# EAGLE schematic transmitter_with_KS0108_LCD (EAGLE 7.7.0)
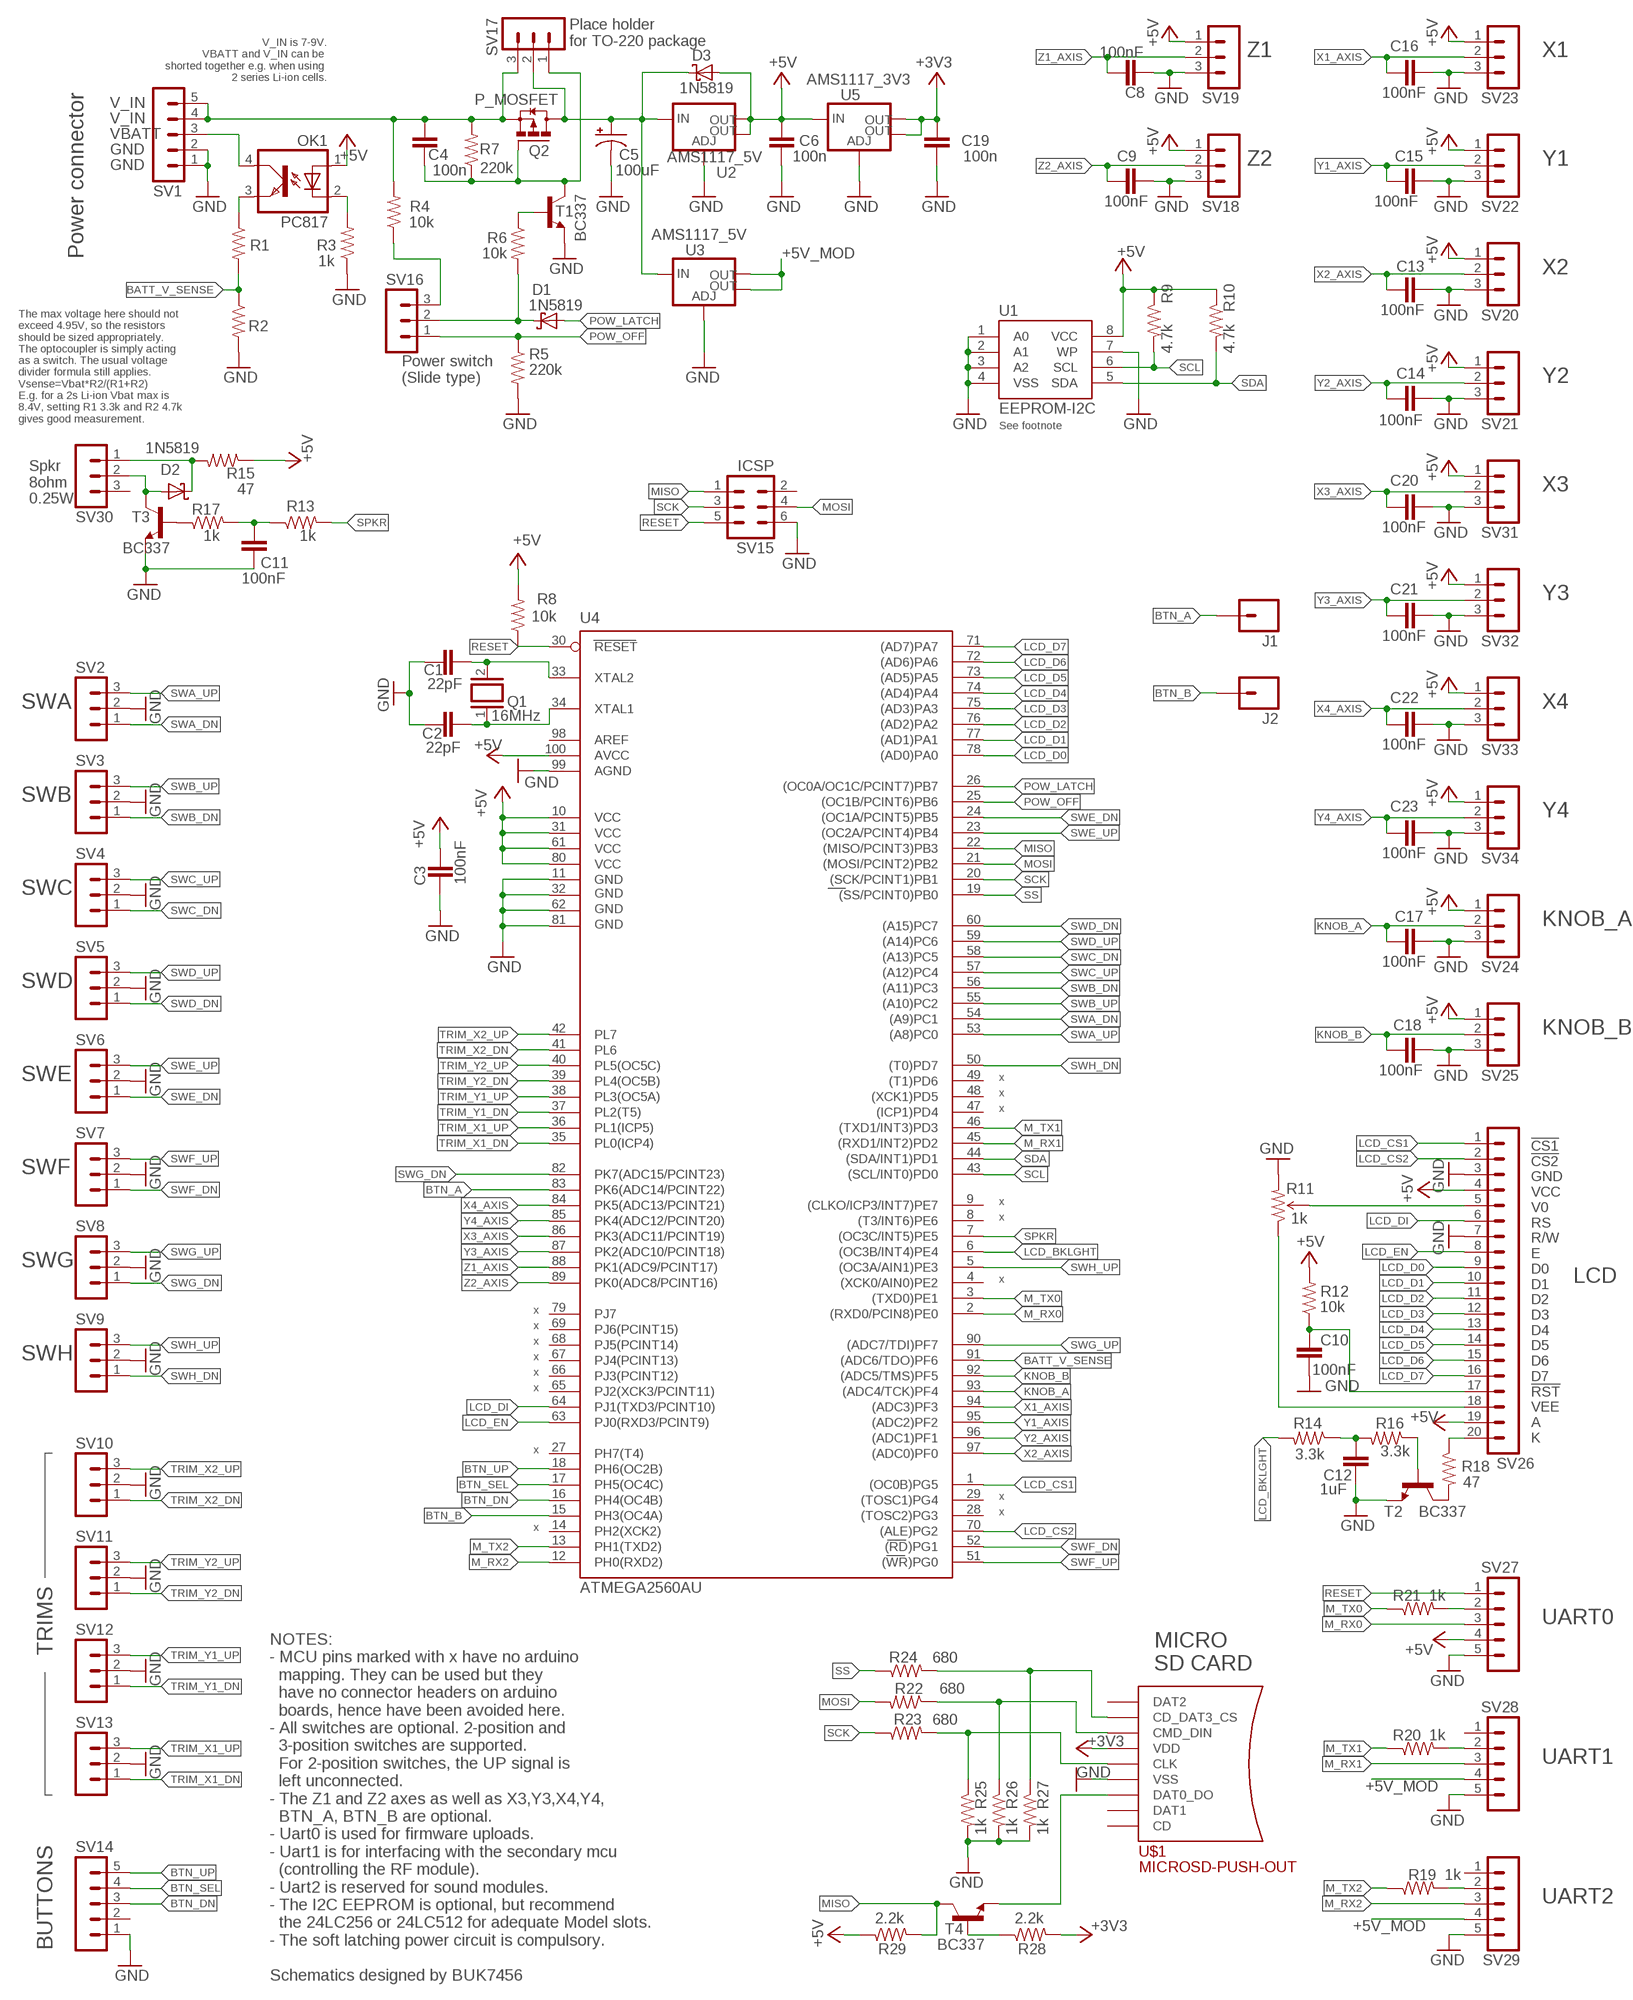
[diagram p0: schematic, sheet 1]

## Parts
C1  22pF  C-EU050-024X044  [C050-024X044]
C2  22pF  C-EU050-024X044  [C050-024X044]
C3  100nF  C-EU050-024X044  [C050-024X044]
C4  100n  C-EU050-024X044  [C050-024X044]
C5  100uF  CPOL-USE2,5-6E  [E2,5-6E]
C6  100n  C-EU050-024X044  [C050-024X044]
C8  100nF  C-EU050-024X044  [C050-024X044]
C9  100nF  C-EU050-024X044  [C050-024X044]
C10  100nF  C-EU050-024X044  [C050-024X044]
C11  100nF  C-EU050-024X044  [C050-024X044]
C12  1uF  C-EU050-024X044  [C050-024X044]
C13  100nF  C-EU050-024X044  [C050-024X044]
C14  100nF  C-EU050-024X044  [C050-024X044]
C15  100nF  C-EU050-024X044  [C050-024X044]
C16  100nF  C-EU050-024X044  [C050-024X044]
C17  100nF  C-EU050-024X044  [C050-024X044]
C18  100nF  C-EU050-024X044  [C050-024X044]
C19  100n  C-EU050-024X044  [C050-024X044]
C20  100nF  C-EU050-024X044  [C050-024X044]
C21  100nF  C-EU050-024X044  [C050-024X044]
C22  100nF  C-EU050-024X044  [C050-024X044]
C23  100nF  C-EU050-024X044  [C050-024X044]
D1  1N5819  1N5817-B  [DO41-7.6]
D2  1N5819  1N5817-B  [DO41-7.6]
D3  1N5819  1N5817-B  [DO41-7.6]
J1  M01PTH_LONGPAD  [1X01_LONGPAD]
J2  M01PTH_LONGPAD  [1X01_LONGPAD]
OK1  PC817  [DIL04]
Q1  16MHz  XTAL/S  [QS]
Q2  P_MOSFET  FDN360P  [SUPER-SOT3]
R1  1k  R-US_0204/5  [0204/5]
R2  1k  R-US_0204/5  [0204/5]
R3  1k  R-US_0204/5  [0204/5]
R4  10k  R-US_0204/5  [0204/5]
R5  220k  R-US_0204/5  [0204/5]
R6  10k  R-US_0204/5  [0204/5]
R7  220k  R-US_0204/5  [0204/5]
R8  10k  R-US_0204/5  [0204/5]
R9  4.7k  R-US_0204/5  [0204/5]
R10  4.7k  R-US_0204/5  [0204/5]
R11  1k  TRIMPOTPTH  [TRIM_POT_PTH]
R12  10k  R-US_0204/5  [0204/5]
R13  1k  R-US_0204/5  [0204/5]
R14  3.3k  R-US_0204/5  [0204/5]
R15  47  R-US_0204/5  [0204/5]
R16  3.3k  R-US_0204/5  [0204/5]
R17  1k  R-US_0204/5  [0204/5]
R18  47  R-US_0204/5  [0204/5]
R19  1k  R-US_0204/5  [0204/5]
R20  1k  R-US_0204/5  [0204/5]
R21  1k  R-US_0204/5  [0204/5]
R22  680  R-US_0204/5  [0204/5]
R23  680  R-US_0204/5  [0204/5]
R24  680  R-US_0204/5  [0204/5]
R25  1k  R-US_0204/5  [0204/5]
R26  1k  R-US_0204/5  [0204/5]
R27  1k  R-US_0204/5  [0204/5]
R28  2.2k  R-US_0204/5  [0204/5]
R29  2.2k  R-US_0204/5  [0204/5]
SV1  MA05-1  [MA05-1]
SV2  MA03-1  [MA03-1]
SV3  MA03-1  [MA03-1]
SV4  MA03-1  [MA03-1]
SV5  MA03-1  [MA03-1]
SV6  MA03-1  [MA03-1]
SV7  MA03-1  [MA03-1]
SV8  MA03-1  [MA03-1]
SV9  MA03-1  [MA03-1]
SV10  MA03-1  [MA03-1]
SV11  MA03-1  [MA03-1]
SV12  MA03-1  [MA03-1]
SV13  MA03-1  [MA03-1]
SV14  MA05-1  [MA05-1]
SV15  ICSP  MA03-2  [MA03-2]
SV16  MA03-1  [MA03-1]
SV17  MA03-1  [MA03-1]
SV18  MA03-1  [MA03-1]
SV19  MA03-1  [MA03-1]
SV20  MA03-1  [MA03-1]
SV21  MA03-1  [MA03-1]
SV22  MA03-1  [MA03-1]
SV23  MA03-1  [MA03-1]
SV24  MA03-1  [MA03-1]
SV25  MA03-1  [MA03-1]
SV26  MA20-1  [MA20-1]
SV27  MA05-1  [MA05-1]
SV28  MA05-1  [MA05-1]
SV29  MA05-1  [MA05-1]
SV30  MA03-1  [MA03-1]
SV31  MA03-1  [MA03-1]
SV32  MA03-1  [MA03-1]
SV33  MA03-1  [MA03-1]
SV34  MA03-1  [MA03-1]
T1  BC337  [TO92]
T2  BC337  [TO92]
T3  BC337  [TO92]
T4  BC337  [TO92]
U1  EEPROM-I2C  EEPROM-I2CEIAJ  [SO08-EIAJ]
U2  AMS1117_5V  V_REG_LM1117SOT223  [SOT223]
U3  AMS1117_5V  V_REG_LM1117SOT223  [SOT223]
U4  ATMEGA2560AU  [TQFP100]
U5  AMS1117_3V3  V_REG_LM1117SOT223  [SOT223]
U$1  MICROSD-PUSH-OUT  [MICROSD-PUSH-OUT]

## Nets
+3V3: C19.2 R28.2 U5.2(OUT) U5.4(OUT) U$1.4(VDD)
+5V: C3.1 C6.2 D3.A OK1.1(A) R8.2 R9.1 R10.1 R12.2 R15.1 R29.1 SV18.1 SV19.1 SV20.1 SV21.1 SV22.1 SV23.1 SV24.1 SV25.1 SV26.4 SV26.19 SV27.4 SV31.1 SV32.1 SV33.1 SV34.1 U1.8(VCC) U2.2(OUT) U2.4(OUT) U4.10(VCC) U4.31(VCC1) U4.61(VCC2) U4.80(VCC3) U4.100(AVCC) U5.3(IN)
+5V_MOD: SV28.4 SV29.4 U3.2(OUT) U3.4(OUT)
BATT_V_SENSE: R1.2 R2.1 U4.91((ADC6/TDO)PF6)
BTN_A: J1.1 U4.83(PK6(ADC14/PCINT22))
BTN_B: J2.1 U4.15(PH3(OC4A))
BTN_DN: SV14.3 U4.16(PH4(OC4B))
BTN_SEL: SV14.4 U4.17(PH5(OC4C))
BTN_UP: SV14.5 U4.18(PH6(OC2B))
GND: C1.1 C2.1 C3.2 C5.- C6.1 C8.2 C9.1 C10.2 C11.2 C12.2 C13.1 C14.1 C15.1 C16.1 C17.1 C18.1 C19.1 C20.1 C21.1 C22.1 C23.1 R2.2 R3.1 R5.2 R11.3(CW) R25.2 R26.2 R27.2 SV1.1 SV1.2 SV2.2 SV3.2 SV4.2 SV5.2 SV6.2 SV7.2 SV8.2 SV9.2 SV10.2 SV11.2 SV12.2 SV13.2 SV14.1 SV15.6 SV18.3 SV19.3 SV20.3 SV21.3 SV22.3 SV23.3 SV24.3 SV25.3 SV26.3 SV26.7 SV27.5 SV28.5 SV29.5 SV31.3 SV32.3 SV33.3 SV34.3 T1.1(E) T2.1(E) T3.1(E) U1.1(A0) U1.2(A1) U1.3(A2) U1.4(VSS) U1.7(WP) U2.1(ADJ) U3.1(ADJ) U4.11(GND) U4.32(GND1) U4.62(GND2) U4.81(GND3) U4.99(AGND) U5.1(ADJ) U$1.6(VSS) U$1.G1(VSS) U$1.G2(VSS) U$1.G3(VSS) U$1.G4(VSS)
KNOB_A: C17.2 SV24.2 U4.93((ADC4/TCK)PF4)
KNOB_B: C18.2 SV25.2 U4.92((ADC5/TMS)PF5)
LCD_BKLGHT: R14.2 U4.6((OC3B/INT4)PE4)
LCD_CS1: SV26.1 U4.1((OC0B)PG5)
LCD_CS2: SV26.2 U4.70((ALE)PG2)
LCD_D0: SV26.9 U4.78((AD0)PA0)
LCD_D1: SV26.10 U4.77((AD1)PA1)
LCD_D2: SV26.11 U4.76((AD2)PA2)
LCD_D3: SV26.12 U4.75((AD3)PA3)
LCD_D4: SV26.13 U4.74((AD4)PA4)
LCD_D5: SV26.14 U4.73((AD5)PA5)
LCD_D6: SV26.15 U4.72((AD6)PA6)
LCD_D7: SV26.16 U4.71((AD7)PA7)
LCD_DI: SV26.6 U4.64(PJ1(TXD3/PCINT10))
LCD_EN: SV26.8 U4.63(PJ0(RXD3/PCINT9))
M_RX0: SV27.3 U4.2((RXD0/PCIN8)PE0)
M_RX1: SV28.3 U4.45((RXD1/INT2)PD2)
M_RX2: SV29.3 U4.12(PH0(RXD2))
M_TX0: R21.1 U4.3((TXD0)PE1)
M_TX1: R20.1 U4.46((TXD1/INT3)PD3)
M_TX2: R19.1 U4.13(PH1(TXD2))
MISO: R29.2 SV15.1 T4.3(C) U4.22((MISO/PCINT3)PB3)
MOSI: R22.2 SV15.4 U4.21((MOSI/PCINT2)PB2)
N$1: C12.1 R14.1 R16.2
N$2: C10.1 R12.1 SV26.17
N$3: R18.2 T2.3(C)
N$4: R16.1 T2.2(B)
N$5: C11.1 R13.1 R17.2
N$6: R21.2 SV27.2
N$7: R20.2 SV28.2
N$8: R19.2 SV29.2
N$9: C1.2 Q1.2 U4.33(XTAL2)
N$10: C2.2 Q1.1 U4.34(XTAL1)
N$11: T4.1(E) U$1.7(DAT0_DO)
N$12: OK1.4(COL) SV1.3
N$13: R11.1(CCW) SV26.18
N$14: R11.2(WIPER) SV26.5
N$15: R18.1 SV26.20
N$16: R24.2 R27.1 U$1.2(CD_DAT3_CS)
N$17: R22.1 R26.1 U$1.3(CMD_DIN)
N$18: R23.2 R25.1 U$1.5(CLK)
N$19: R28.1 T4.2(B)
N$20: R17.1 T3.2(B)
N$21: D2.A SV30.2 T3.3(C)
N$22: D2.C R15.2 SV30.1
N$29: R6.1 T1.2(B)
N$30: D1.C R6.2 SV16.2
N$38: OK1.3(EMIT) R1.1
N$39: C4.2 Q2.2(S) R4.2 R7.2 SV1.4 SV1.5 SV17.3
N$43: C4.1 Q2.1(G) R7.1 SV17.1 T1.3(C)
N$44: OK1.2(C) R3.2
N$45: R4.1 SV16.3
N$47: C5.+ D3.C Q2.3(D) SV17.2 U2.3(IN) U3.3(IN)
POW_LATCH: D1.A U4.26((OC0A/OC1C/PCINT7)PB7)
POW_OFF: R5.1 SV16.1 U4.25((OC1B/PCINT6)PB6)
RESET: R8.1 SV15.5 SV27.1 U4.30(RESET)
SCK: R23.1 SV15.3 U4.20((SCK/PCINT1)PB1)
SCL: R9.2 U1.6(SCL) U4.43((SCL/INT0)PD0)
SDA: R10.2 U1.5(SDA) U4.44((SDA/INT1)PD1)
SPKR: R13.2 U4.7((OC3C/INT5)PE5)
SS: R24.1 U4.19((SS/PCINT0)PB0)
SWA_DN: SV2.1 U4.54((A9)PC1)
SWA_UP: SV2.3 U4.53((A8)PC0)
SWB_DN: SV3.1 U4.56((A11)PC3)
SWB_UP: SV3.3 U4.55((A10)PC2)
SWC_DN: SV4.1 U4.58((A13)PC5)
SWC_UP: SV4.3 U4.57((A12)PC4)
SWD_DN: SV5.1 U4.60((A15)PC7)
SWD_UP: SV5.3 U4.59((A14)PC6)
SWE_DN: SV6.1 U4.24((OC1A/PCINT5)PB5)
SWE_UP: SV6.3 U4.23((OC2A/PCINT4)PB4)
SWF_DN: SV7.1 U4.52((RD)PG1)
SWF_UP: SV7.3 U4.51((WR)PG0)
SWG_DN: SV8.1 U4.82(PK7(ADC15/PCINT23))
SWG_UP: SV8.3 U4.90((ADC7/TDI)PF7)
SWH_DN: SV9.1 U4.50((T0)PD7)
SWH_UP: SV9.3 U4.5((OC3A/AIN1)PE3)
TRIM_X1_DN: SV13.1 U4.35(PL0(ICP4))
TRIM_X1_UP: SV13.3 U4.36(PL1(ICP5))
TRIM_X2_DN: SV10.1 U4.41(PL6)
TRIM_X2_UP: SV10.3 U4.42(PL7)
TRIM_Y1_DN: SV12.1 U4.37(PL2(T5))
TRIM_Y1_UP: SV12.3 U4.38(PL3(OC5A))
TRIM_Y2_DN: SV11.1 U4.39(PL4(OC5B))
TRIM_Y2_UP: SV11.3 U4.40(PL5(OC5C))
X1_AXIS: C16.2 SV23.2 U4.94((ADC3)PF3)
X2_AXIS: C13.2 SV20.2 U4.97((ADC0)PF0)
X3_AXIS: C20.2 SV31.2 U4.86(PK3(ADC11/PCINT19))
X4_AXIS: C22.2 SV33.2 U4.84(PK5(ADC13/PCINT21))
Y1_AXIS: C15.2 SV22.2 U4.95((ADC2)PF2)
Y2_AXIS: C14.2 SV21.2 U4.96((ADC1)PF1)
Y3_AXIS: C21.2 SV32.2 U4.87(PK2(ADC10/PCINT18))
Y4_AXIS: C23.2 SV34.2 U4.85(PK4(ADC12/PCINT20))
Z1_AXIS: C8.1 SV19.2 U4.88(PK1(ADC9/PCINT17))
Z2_AXIS: C9.2 SV18.2 U4.89(PK0(ADC8/PCINT16))
Unconnected: SV14.2 SV15.2 SV28.1 SV29.1 SV30.3 U4.4((XCK0/AIN0)PE2) U4.8((T3/INT6)PE6) U4.9((CLKO/ICP3/INT7)PE7) U4.14(PH2(XCK2)) U4.27(PH7(T4)) U4.28((TOSC2)PG3) U4.29((TOSC1)PG4) U4.47((ICP1)PD4) U4.48((XCK1)PD5) U4.49((T1)PD6) U4.65(PJ2(XCK3/PCINT11)) U4.66(PJ3(PCINT12)) U4.67(PJ4(PCINT13)) U4.68(PJ5(PCINT14)) U4.69(PJ6(PCINT15)) U4.79(PJ7) U4.98(AREF) U$1.1(DAT2) U$1.8(DAT1) U$1.CD

## Notes on the sheet
- V_IN is 7-9V.
  VBATT and V_IN can be 
  shorted together e.g. when using 
  2 series Li-ion cells.
- Place holder
  for TO-220 package
- Z1 | X1
- V_IN
- V_IN
- VBATT
- GND
- Z2 | Y1
- GND
- Power connector
- X2
- Power switch
  (Slide type)
- Y2
- See footnote
- The max voltage here should not 
  exceed 4.95V, so the resistors
  should be sized appropriately.
  The optocoupler is simply acting
  as a switch. The usual voltage 
  divider formula still applies.
  Vsense=Vbat*R2/(R1+R2)
  E.g. for a 2s Li-ion Vbat max is
  8.4V, setting R1 3.3k and R2 4.7k
  gives good measurement.
- Spkr
  8ohm 
  0.25W
- X3
- Y3
- SWA | X4
- SWB
- Y4
- SWC
- KNOB_A
- SWD
- KNOB_B
- SWE | x
- x
- x
- SWF
- x
- x
- SWG
- x | LCD
- x
- x
- x
- SWH | x
- x
- x
- !CS1
  !CS2
  GND
  VCC
  V0
  RS
  R/W
  E
  D0
  D1
  D2
  D3
  D4
  D5
  D6
  D7
  !RST
  VEE
  A
  K
- x
- x
- x
- x
- UART0
- TRIMS
- MICRO 
  SD CARD
- UART1
- UART2
- BUTTONS
- NOTES:
  - MCU pins marked with x have no arduino
    mapping. They can be used but they
    have no connector headers on arduino
    boards, hence have been avoided here.
  - All switches are optional. 2-position and 
    3-position switches are supported. 
    For 2-position switches, the UP signal is 
    left unconnected.
  - The Z1 and Z2 axes as well as X3,Y3,X4,Y4, 
    BTN_A, BTN_B are optional.
  - Uart0 is used for firmware uploads.
  - Uart1 is for interfacing with the secondary mcu 
    (controlling the RF module).
  - Uart2 is reserved for sound modules.
  - The I2C EEPROM is optional, but recommend 
    the 24LC256 or 24LC512 for adequate Model slots.
  - The soft latching power circuit is compulsory.
  
  Schematics designed by BUK7456

## Library data of the parts
C1-C4 C6 C8-C23 = rcl:C-EU: CAPACITOR, European symbol
C5 = rcl:CPOL-US: POLARIZED CAPACITOR, American symbol
D1-D3 = diode:1N581*: 1.0A SCHOTTKY BARRIER RECTIFIER Source: http://www.diodes.com/datasheets/ds23001.pdf
J1 J2 = SparkFun-Connectors:M01: Header 1 Standard 1-pin 0.1" header. Use with straight break away headers (SKU : PRT-00116), right angle break away headers (PRT-00553), swiss pins (PRT-00743), machine pins (PRT-00117), and female headers (PRT-00115). SMTSO-256-ET is a "flush mount" nut for a 4-40 screw. The older package used to be too tight, and did not allow it to sit properly thru the drill hit. The latest (0.165DIA) fits nice and snug.
OK1 = optocoupler:PC817: SHARP OPTO COUPLER; MPN: PC817X4J000F; OC_FARNELL: 9707727; OC_NEWARK: 97K7059
Q1 = special:XTAL/S: CRYSTAL
Q2 = transistor-power:FDN360P: Single P-Channel, PowerTrench (R) MOSFET Source: http://www.fairchildsemi.com/ds/FD/FDN360P.pdf
R1-R10 R13-R29 = rcl:R-US_: RESISTOR, American symbol
R11 = SparkFun-Electromechanical:TRIMPOT: Various small potentiometers for "set-and-forget" applications
R12 = resistor:R-US_: RESISTOR, American symbol
SV1 SV14 SV27-SV29 = con-lstb:MA05-1: PIN HEADER; OC_FARNELL: unknown; OC_NEWARK: unknown
SV2-SV13 SV16-SV25 SV30-SV34 = con-lstb:MA03-1: PIN HEADER; OC_FARNELL: unknown; OC_NEWARK: unknown
SV15 = con-lstb:MA03-2: PIN HEADER; OC_FARNELL: unknown; OC_NEWARK: unknown
SV26 = con-lstb:MA20-1: PIN HEADER; OC_FARNELL: unknown; OC_NEWARK: unknown
T1-T4 = transistor:BC337: NPN TRANSISTOR
U1 = SparkFun-DigitalIC:EEPROM-I2C: I2C EEPROM chips, 24LC256 (and others)
U2 U3 U5 = SparkFun-PowerIC:V_REG_LM1117: Voltage Regulator LM1117 Standard adjustable voltage regulator but in SMD form. Spark Fun Electronics SKU : COM-00595; PROD_ID: VREG-08170
U4 = SparkFun-DigitalIC:ATMEGA2560: Atmel 100-pin 8-bit uC 64/128/256 Kbytes FLASH 4 Kbytes EEPROM 8 Kbytes SRAM 86 General Purpose I/O pins 12-channels16-bit PWM 4 x Serial USARTs 16-channels 10-bit A/D; PROD_ID: IC-10040
U$1 = microsd:MICROSD-PUSH-OUT: T-Flash Push-Out Micro SD Card Reader 14.75mm x 14.5mm SMD with external pins